# EAGLE design control_board (EAGLE 8.3.1)
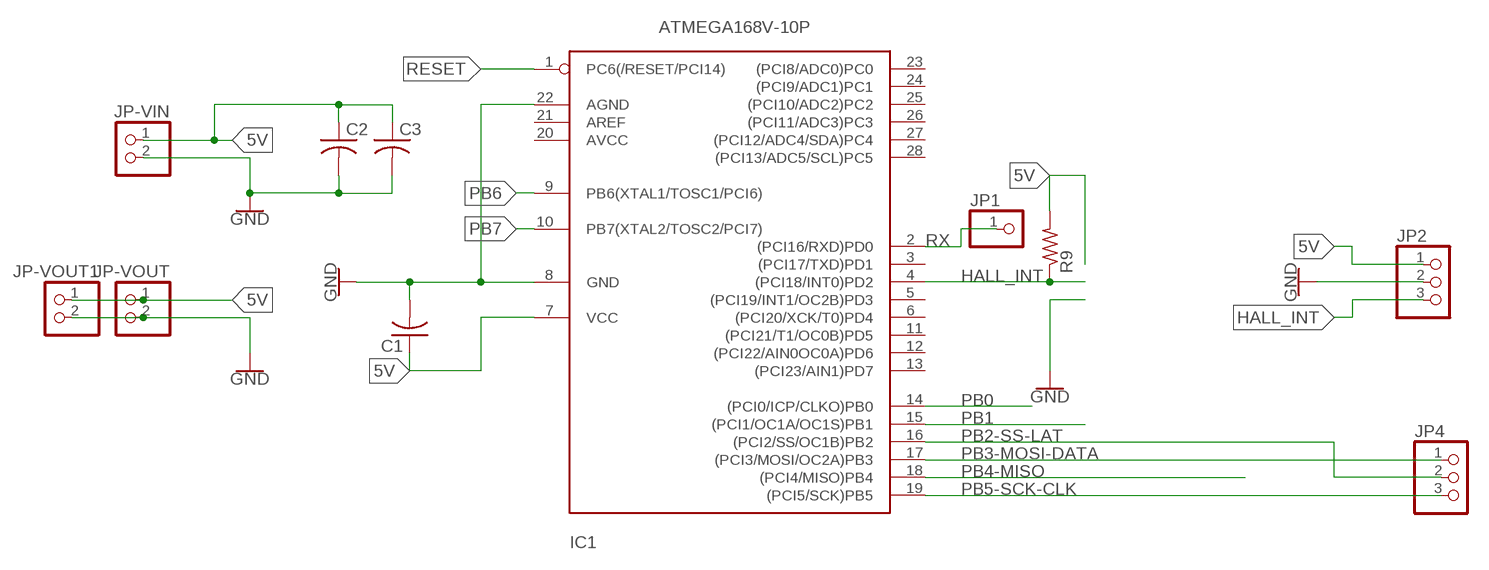
[diagram p0: schematic, sheet 1]

## Parts
C1  C-US025-030X050  [C025-030X050]
C2  C-US025-060X050  [C025-060X050]
C3  C-US025-060X050  [C025-060X050]
IC1  ATMEGA168V-10P  [DIL28-3]
JP1  PINHD-1X1  [1X01]
JP2  PINHD-1X3  [1X03]
JP4  PINHD-1X3  [1X03]
JP-VIN  PINHD-1X2  [1X02]
JP-VOUT  PINHD-1X2  [1X02]
JP-VOUT1  PINHD-1X2  [1X02]
R9  R-US_0207/7  [0207/7]

## Nets
5V: C1.1 C2.1 C3.1 IC1.7(VCC) JP2.1 JP-VIN.1 JP-VOUT1.1 JP-VOUT.1 R9.2
GND: C1.2 C2.2 C3.2 IC1.8(GND) IC1.22(AGND) JP2.2 JP-VIN.2 JP-VOUT1.2 JP-VOUT.2
HALL_INT: IC1.4((PCI18/INT0)PD2) JP2.3 R9.1
PB0: IC1.14((PCI0/ICP/CLKO)PB0)
PB1: IC1.15((PCI1/OC1A/OC1S)PB1)
PB2-SS-LAT: IC1.16((PCI2/SS/OC1B)PB2) JP4.2
PB3-MOSI-DATA: IC1.17((PCI3/MOSI/OC2A)PB3) JP4.1
PB4-MISO: IC1.18((PCI4/MISO)PB4)
PB5-SCK-CLK: IC1.19((PCI5/SCK)PB5) JP4.3
PB6: IC1.9(PB6(XTAL1/TOSC1/PCI6))
PB7: IC1.10(PB7(XTAL2/TOSC2/PCI7))
RESET: IC1.1(PC6(/RESET/PCI14))
RX: IC1.2((PCI16/RXD)PD0) JP1.1
Unconnected: IC1.3((PCI17/TXD)PD1) IC1.5((PCI19/INT1/OC2B)PD3) IC1.6((PCI20/XCK/T0)PD4) IC1.11((PCI21/T1/OC0B)PD5) IC1.12((PCI22/AIN0OC0A)PD6) IC1.13((PCI23/AIN1)PD7) IC1.20(AVCC) IC1.21(AREF) IC1.23((PCI8/ADC0)PC0) IC1.24((PCI9/ADC1)PC1) IC1.25((PCI10/ADC2)PC2) IC1.26((PCI11/ADC3)PC3) IC1.27((PCI12/ADC4/SDA)PC4) IC1.28((PCI13/ADC5/SCL)PC5)

## Library data of the parts
C1-C3 = adafruit:C-US: CAPACITOR, American symbol
IC1 = adafruit:ATMEGA168*P: MICROCONTROLLER 16 kBytes FLASH 1 kBytes SRAM 512 Bytes EEPROM USART 8-channel 10 bit ADC
JP1 = pinhead:PINHD-1X1: PIN HEADER
JP2 JP4 = pinhead:PINHD-1X3: PIN HEADER
JP-VIN JP-VOUT JP-VOUT1 = pinhead:PINHD-1X2: PIN HEADER
R9 = adafruit:R-US_: RESISTOR, American symbol

## Board
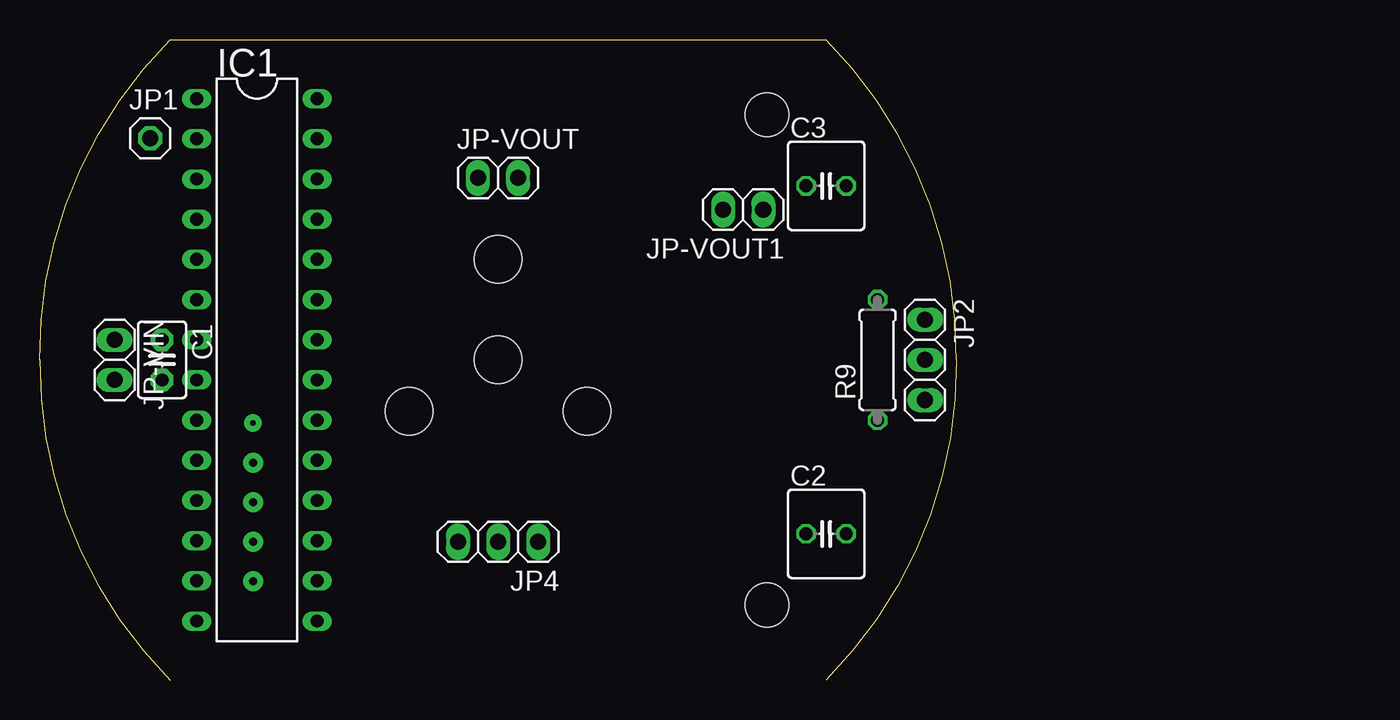
[diagram p1: board, top side]
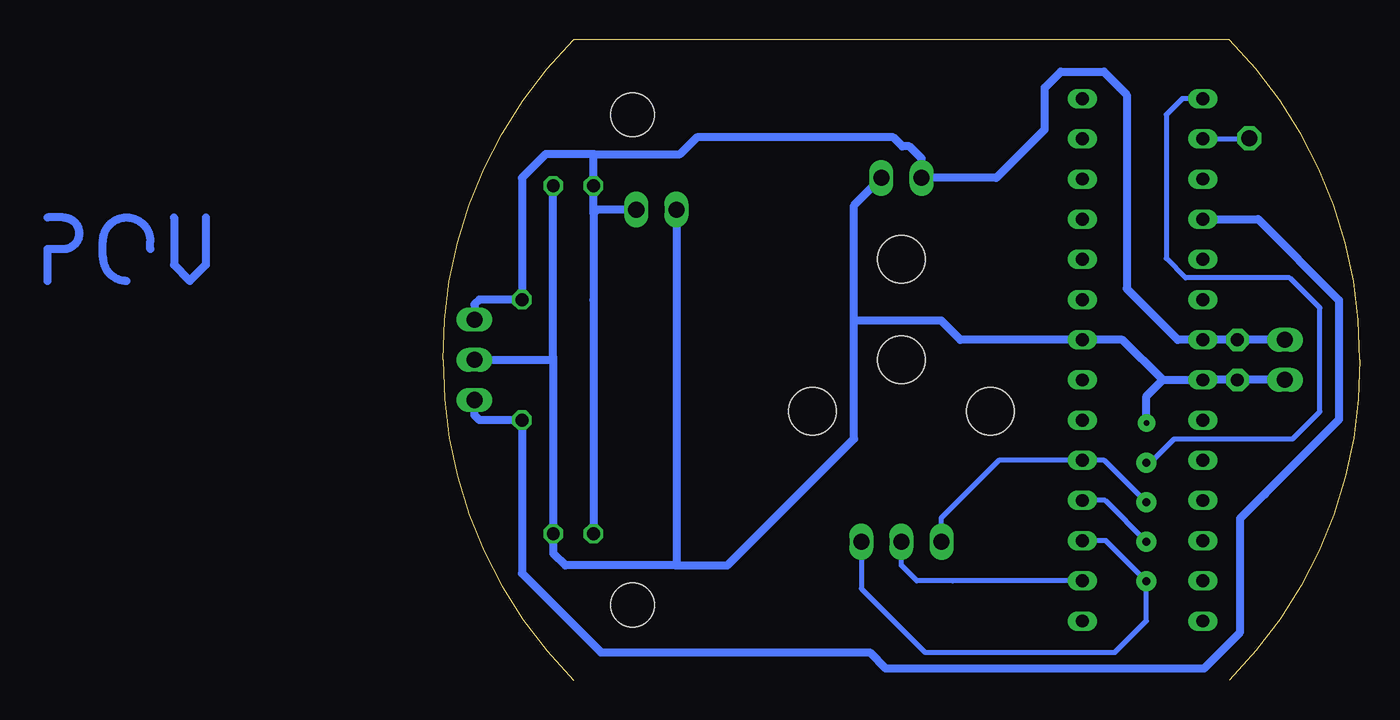
[diagram p2: board, bottom side, seen from below]

Size 58 x 40.5 mm. Coordinates in mm from the lower left corner, seen from the top.
Outline: 8.25,0 arc-45 0,20.25 arc-45 8.25,40.5 49.75,40.5 arc-45 58,20.25 arc-45 49.75,0
Copper layers (1*16): Top 0.035mm / dielectric 1.5mm / Bottom 0.035mm
Design rules "OthermillDRC_1_64_v2": minimum track width 16mil, minimum drill 31mil, track to track 0.39878125mm, track to pad 0.39878125mm, pad to pad 0.39878125mm, via to via 0.39878125mm, smd to smd 0mil, copper to edge 0mil, drill to drill 1mil, minimum pad ring 0mil, minimum via ring 15mil, stop-mask expansion 1mil, vias tented up to drill 30mil, thermal gap 10mil
Holes 3 mm at 29,20.25 29,26.6 34.63,17 23.37,17
Holes 2.75 mm at 46,35.75 46,4.75

### Footprints (pad centres in the part's own frame; a part is rotated, then mirrored left to right if it is on the bottom)
C025-030X050 = drill 0.813 pad 1.422 octagon: 1 -1.27,0; 2 1.27,0
C025-060X050 = drill 0.813 octagon: 1 -1.27,0; 2 1.27,0
DIL28-3 = drill 0.813 long: 1 -16.51,-3.81; 2 -13.97,-3.81; 3 -11.43,-3.81; 4 -8.89,-3.81; 5 -6.35,-3.81; 6 -3.81,-3.81; 7 -1.27,-3.81; 8 1.27,-3.81; 9 3.81,-3.81; 10 6.35,-3.81; 11 8.89,-3.81; 12 11.43,-3.81; 13 13.97,-3.81; 14 16.51,-3.81; 15 16.51,3.81; 16 13.97,3.81; 17 11.43,3.81; 18 8.89,3.81; 19 6.35,3.81; 20 3.81,3.81; 21 1.27,3.81; 22 -1.27,3.81; 23 -3.81,3.81; 24 -6.35,3.81; 25 -8.89,3.81; 26 -11.43,3.81; 27 -13.97,3.81; 28 -16.51,3.81
1X01 = drill 1.016 octagon: 1 0,0
1X03 = drill 1.016 long: 1 -2.54,0; 2 0,0; 3 2.54,0
1X02 = drill 1.016 long: 1 -1.27,0; 2 1.27,0
0207/7 = drill 0.813 octagon: 1 -3.81,0; 2 3.81,0

### Placement (x,y rotation side)
C1  7.75,20.25 270 top
C2  49.75,9.25 0 top
C3  49.75,31.25 0 top
IC1  13.75,20.25 270 top
JP1  7,34.25 0 top
JP2  56,20.25 270 top
JP4  29,8.75 180 top
JP-VIN  4.75,20.25 270 top
JP-VOUT  29,31.75 0 top
JP-VOUT1  44.5,29.75 180 top
R9  53,20.25 90 top

### Tracks (layer width: path | path; a pad name or v marks a point on that pad's centre or on a via)
5V
  Bottom 0.508: JP-VIN.1 C1.1 IC1.7 11.52,21.52 14.75,24.75 14.75,37 15.19,37.44 15.19,37.47 16.19,38.47 18.93,38.47 19.93,37.47 19.93,34.82 23,31.75 JP-VOUT.1 27.73,32.98 28.5,33.75 28.95,33.75 29.52,34.32 41.93,34.32 43,33.25 48.46,33.25 | 48.48,29.52 48.48,24.03 | 48.48,29.52 C3.1 48.48,33.23 48.46,33.25 | 48.48,24.03 C2.1 | JP2.1 56,23.75 55.69,24.06 R9.2 53,31.75 51.5,33.25 48.46,33.25 | 48.47,24.02 48.48,24.03 | JP-VOUT1.1 48.25,29.75 48.48,29.52
GND  (via drill 0.35)
  Bottom 0.508: JP-VIN.2 C1.2 IC1.8 12.48,18.98 | 12.48,18.98 15.02,21.52 IC1.22 25.27,21.52 26.5,22.75 32,22.75 | 51.02,20.39 C3.2 | 51.02,20.39 C2.2 51.02,8.02 50.25,7.25 43.26,7.25 | JP2.2 51.16,20.25 51.02,20.39 | 32,22.75 32,30.02 JP-VOUT.2 | 43.26,7.25 40,7.25 32,15.25 32,22.75 | v13.5,16.25 13.5,17.96 12.48,18.98 | JP-VOUT1.2 43.23,7.28 43.26,7.25
HALL_INT
  Bottom 0.508: JP2.3 56,16.75 55.69,16.44 R9.1 53,6.75 48,1.75 31,1.75 30,0.75 9.85,0.75 7.57,3.03 7.57,10.23 6,11.8 | 6,11.75 6,11.8 | 6,11.8 1.33,16.47 1.33,24.03 6.44,29.14 IC1.4
O
  Bottom 0.508: 76.5,27.25 76.5,27.75 arc-90 78,29.25 arc-90 79.5,27.75 79.5,26.75 arc-90 78,25.25
P
  Bottom 0.508: 83,25.25 83,27.25 82,27.25 arc-90 81,28.25 arc-90 82,29.25 83,29.25
PB0
  Bottom 0.305: 10.25,3.43 IC1.14
PB2-SS-LAT
  Bottom 0.305: JP4.2 29,7.25 28.03,6.28 25.75,6.28 | IC1.16 25.75,6.28 | 25.75,6.28
PB3-MOSI-DATA  (via drill 0.5)
  Bottom 0.305: IC1.17 16.07,8.82 v13.5,6.25 13.5,3.75 15.5,1.75 27.5,1.75 31.54,5.79 JP4.1
PB4-MISO  (via drill 0.5)
  Bottom 0.305: IC1.18 16.11,11.36 v13.5,8.75
PB5-SCK-CLK  (via drill 0.5)
  Bottom 0.305: v13.5,11.25 16.15,13.9 IC1.19 22.85,13.9 26.5,10.25 26.5,8.79 JP4.3
RESET  (via drill 0.5)
  Bottom 0.305: IC1.1 11.24,36.76 12.25,35.75 12.25,26.66 11.03,25.44 4.44,25.44 2.53,23.53 2.53,16.97 4.25,15.25 11.75,15.25 13.25,13.75 v13.5,13.75
RX
  Bottom 0.305: IC1.2 7.03,34.22 JP1.1
V
  Bottom 0.508: 75,29.25 75,26.25 74,25.25 73,26.25 73,29.25